# EAGLE design main_smd_v13 (EAGLE 5.11)
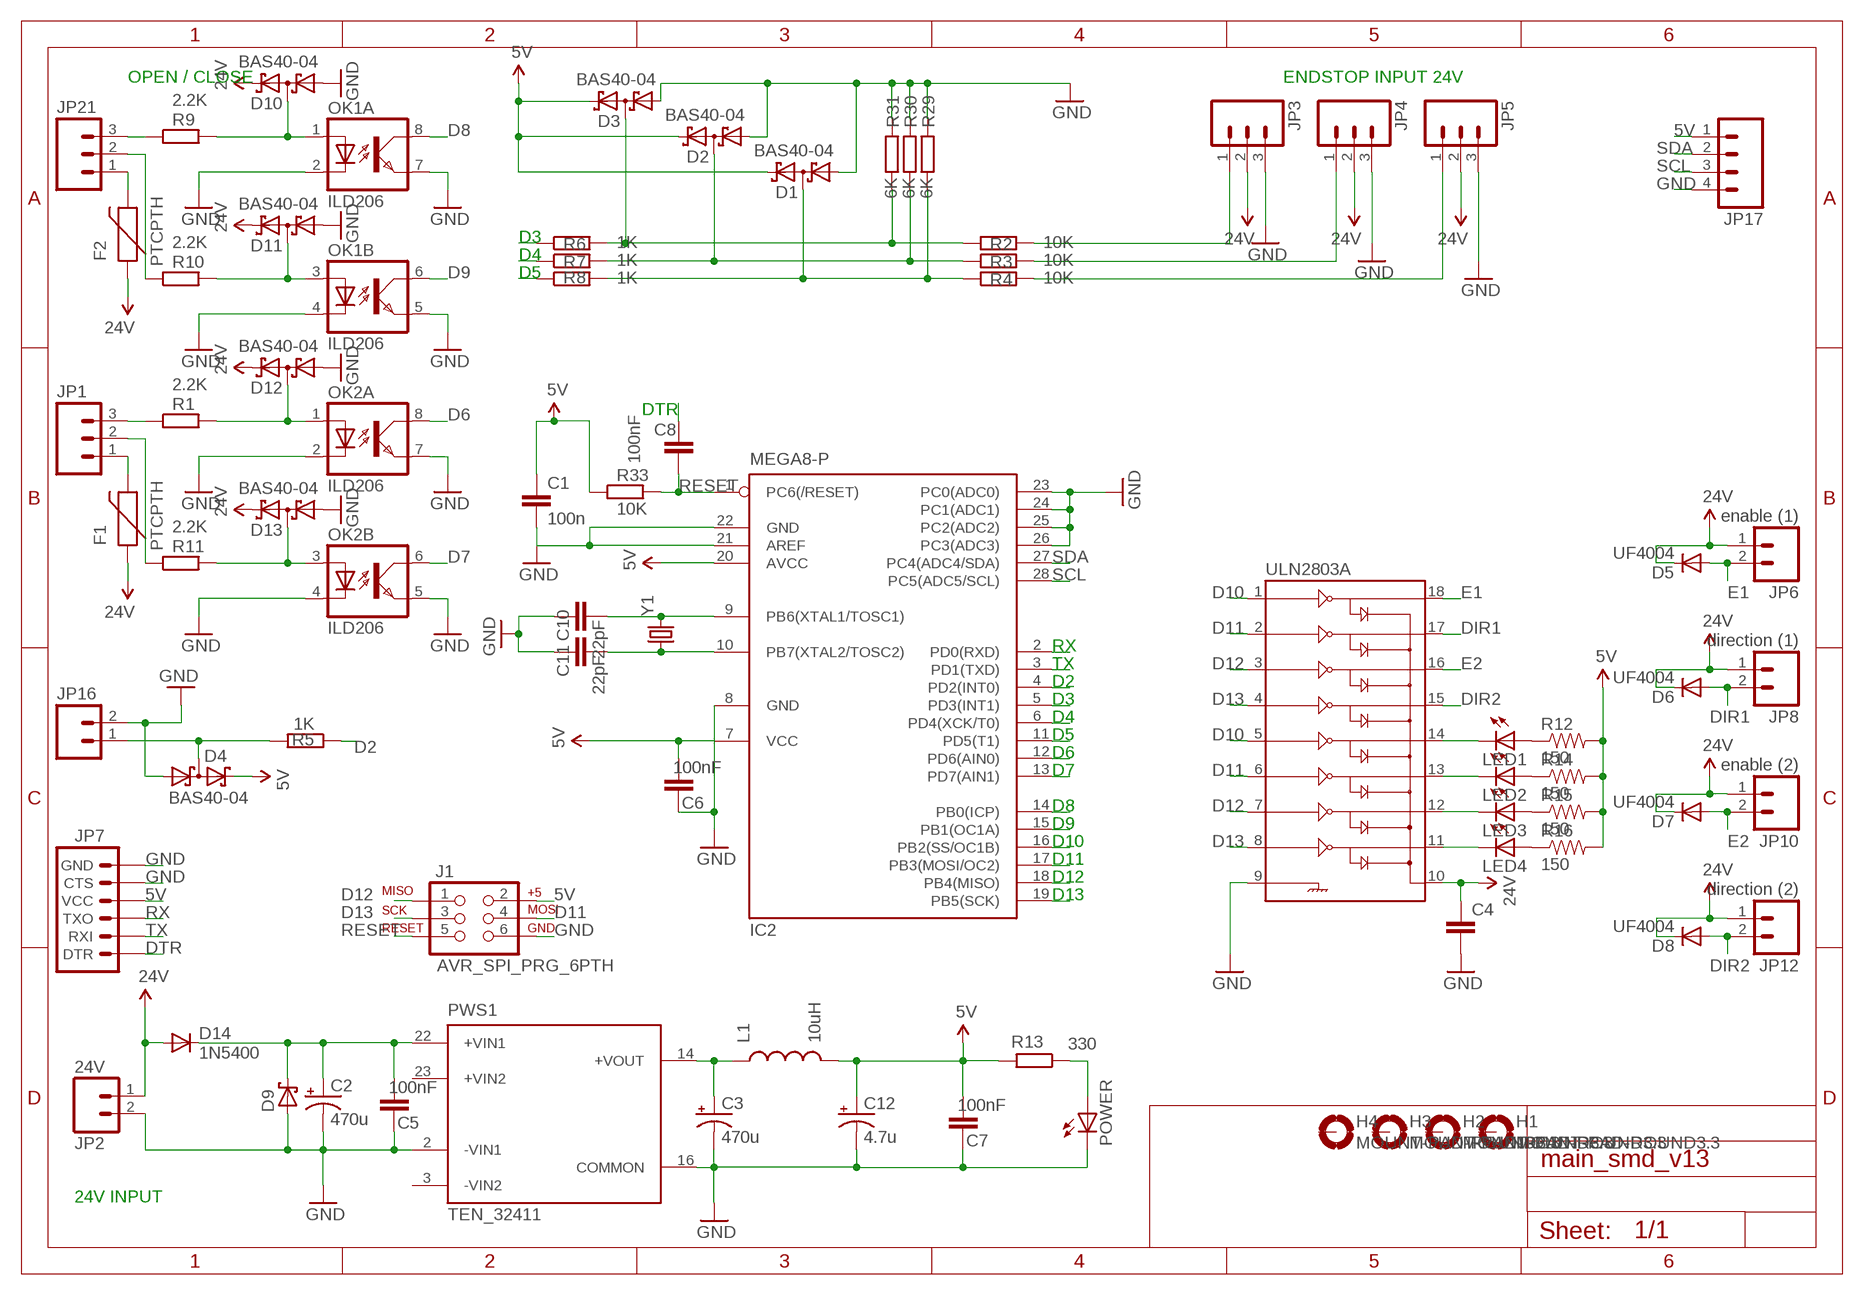
[diagram p0: schematic, sheet 1]

## Parts
C1  100n  CAP0805  [0805]
C2  470u  CAP_POLE  [PANASONIC_E]
C3  470u  CAP_POLD  [PANASONIC_D]
C4  CAP0805  [0805]
C5  100nF  CAP1210  [1210]
C6  100nF  CAP1210  [1210]
C7  100nF  CAP1210  [1210]
C8  100nF  CAP0805  [0805]
C10  22pF  CAP0805  [0805]
C11  22pF  CAP0805  [0805]
C12  4.7u  CAP_POLSMD  [VISHAY_C]
D1  BAS40-04  [SOT23]
D2  BAS40-04  [SOT23]
D3  BAS40-04  [SOT23]
D4  BAS40-04  [SOT23]
D5  UF4004  1N4004  [DO41-10]
D6  UF4004  1N4004  [DO41-10]
D7  UF4004  1N4004  [DO41-10]
D8  UF4004  1N4004  [DO41-10]
D9  SCHOTTKY-DIODECB417-15  [CB417-15]
D10  BAS40-04  [SOT23]
D11  BAS40-04  [SOT23]
D12  BAS40-04  [SOT23]
D13  BAS40-04  [SOT23]
D14  1N5400  [DO201-15]
F1  PTCPTH  [PTC]
F2  PTCPTH  [PTC]
H1  MOUNT-PAD-ROUND3.3  [3,3-PAD]
H2  MOUNT-PAD-ROUND3.3  [3,3-PAD]
H3  MOUNT-PAD-ROUND3.3  [3,3-PAD]
H4  MOUNT-PAD-ROUND3.3  [3,3-PAD]
IC2  MEGA8-P  [DIL28-3]
J1  AVR_SPI_PRG_6PTH  [2X3]
JP1  M03SCREW  [SCREWTERMINAL-3.5MM-3]
JP2  24V  M023.5MM_LOCK  [SCREWTERMINAL-3.5MM-2_LOCK]
JP3  M03SCREW  [SCREWTERMINAL-3.5MM-3]
JP4  M03SCREW  [SCREWTERMINAL-3.5MM-3]
JP5  M03SCREW  [SCREWTERMINAL-3.5MM-3]
JP6  enable (1)  M023.5MM_LOCK  [SCREWTERMINAL-3.5MM-2_LOCK]
JP7  ARDUINO_SERIAL_PROGRAMLONGPADS  [1X06_LONGPADS]
JP8  direction (1)  M023.5MM_LOCK  [SCREWTERMINAL-3.5MM-2_LOCK]
JP10  enable (2)  M023.5MM_LOCK  [SCREWTERMINAL-3.5MM-2_LOCK]
JP12  direction (2)  M023.5MM_LOCK  [SCREWTERMINAL-3.5MM-2_LOCK]
JP16  M023.5MM_LOCK  [SCREWTERMINAL-3.5MM-2_LOCK]
JP17  M04LONGPADS  [1X04_LONGPADS]
JP21  M03SCREW  [SCREWTERMINAL-3.5MM-3]
L1  10uH  INDUCTORSRU5028  [SRU5028]
LED1  LED1206  [LED-1206]
LED2  LED1206  [LED-1206]
LED3  LED1206  [LED-1206]
LED4  LED1206  [LED-1206]
OK1  ILD206  [SOIC08]
OK2  ILD206  [SOIC08]
POWER  LED1206  [LED-1206]
PWS1  TEN_32411  [TEN3XXXX]
R1  2.2K  R-EU_R1210  [R1210]
R2  10K  R-EU_R0805  [R0805]
R3  10K  R-EU_R0805  [R0805]
R4  10K  R-EU_R0805  [R0805]
R5  1K  R-EU_R0805  [R0805]
R6  1K  R-EU_R0805  [R0805]
R7  1K  R-EU_R0805  [R0805]
R8  1K  R-EU_R0805  [R0805]
R9  2.2K  R-EU_R1210  [R1210]
R10  2.2K  R-EU_R1210  [R1210]
R11  2.2K  R-EU_R1210  [R1210]
R12  150  RESISTOR0805-RES  [0805]
R13  330  R-EU_R1210  [R1210]
R14  150  RESISTOR0805-RES  [0805]
R15  150  RESISTOR0805-RES  [0805]
R16  150  RESISTOR0805-RES  [0805]
R29  6K  R-EU_R0805  [R0805]
R30  6K  R-EU_R0805  [R0805]
R31  6K  R-EU_R0805  [R0805]
R33  10K  R-EU_R0805  [R0805]
ULN2803A  ULN2803SOICW  [SO18L]
Y1  CRYSTALSMD  [HC49UP]

## Nets
1.0V [POWER]: C4.1 D5.C D6.C D7.C D8.C D10.2(C2) D11.2(C2) D12.2(C2) D13.2(C2) D14.A F1.P$1 F2.P$1 JP2.1 JP3.2 JP4.2 JP5.2 JP6.1 JP8.1 JP10.1 JP12.1 ULN2803A.10 ; supply symbol labelled 24V
5V [POWER]: C1.1 C6.2 C7.2 C12.+ D1.2(C2) D2.2(C2) D3.2(C2) D4.2(C2) IC2.7(VCC) IC2.20(AVCC) J1.2 JP7.4(VCC) JP17.1 L1.2 R12.2 R13.2 R14.2 R15.2 R16.2 R33.1
D2: IC2.4(PD2(INT0)) R5.1
D3: IC2.5(PD3(INT1)) R6.1
D4: IC2.6(PD4(XCK/T0)) R7.1
D5: IC2.11(PD5(T1)) R8.1
D6: IC2.12(PD6(AIN0)) OK2.8(A:COL)
D7: IC2.13(PD7(AIN1)) OK2.6(B:COL)
D8: IC2.14(PB0(ICP)) OK1.8(A:COL)
D9: IC2.15(PB1(OC1A)) OK1.6(B:COL)
D10: IC2.16(PB2(SS/OC1B)) ULN2803A.1 ULN2803A.5
D11: IC2.17(PB3(MOSI/OC2)) J1.4 ULN2803A.2 ULN2803A.6
D12: IC2.18(PB4(MISO)) J1.1 ULN2803A.3 ULN2803A.7
D13: IC2.19(PB5(SCK)) J1.3 ULN2803A.4 ULN2803A.8
DIR1: D6.A JP8.2 ULN2803A.17
DIR2: D8.A JP12.2 ULN2803A.15
DTR: C8.1 JP7.1(DTR)
E1: D5.A JP6.2 ULN2803A.18
E2: D7.A JP10.2 ULN2803A.16
GND [POWER]: C1.2 C2.- C3.- C4.2 C5.1 C6.1 C7.1 C10.1 C11.1 C12.- D1.1(A1) D2.1(A1) D3.1(A1) D4.1(A1) D9.A D10.1(A1) D11.1(A1) D12.1(A1) D13.1(A1) IC2.8(GND) IC2.21(AREF) IC2.22(GND) IC2.23(PC0(ADC0)) IC2.24(PC1(ADC1)) IC2.25(PC2(ADC2)) IC2.26(PC3(ADC3)) J1.6 JP2.2 JP3.3 JP4.3 JP5.3 JP7.5(CTS) JP7.6(GND) JP16.2 JP17.4 OK1.2(A:C) OK1.4(B:C) OK1.5(B:EMIT) OK1.7(A:EMIT) OK2.2(A:C) OK2.4(B:C) OK2.5(B:EMIT) OK2.7(A:EMIT) POWER.C PWS1.2(-VIN1) PWS1.16(COMMON) R29.2 R30.2 R31.2 ULN2803A.9
N$1: JP21.3 R9.1
N$2: D10.3(C1A2) OK1.1(A:A) R9.2
N$3: JP3.1 R2.2
N$4: D4.3(C1A2) JP16.1 R5.2
N$5: JP4.1 R3.2
N$6: JP5.1 R4.2
N$7: JP21.2 R10.1
N$8: D11.3(C1A2) OK1.3(B:A) R10.2
N$9: D3.3(C1A2) R2.1 R6.2 R31.1
N$10: POWER.A R13.1
N$11: JP1.3 R1.1
N$12: D2.3(C1A2) R3.1 R7.2 R30.1
N$13: D1.3(C1A2) R4.1 R8.2 R29.1
N$14: D12.3(C1A2) OK2.1(A:A) R1.2
N$15: JP1.2 R11.1
N$16: D13.3(C1A2) OK2.3(B:A) R11.2
N$17: F2.P$2 JP21.1
N$18: F1.P$2 JP1.1
N$19: LED3.A R15.1
N$20: LED1.A R12.1
N$21: LED2.A R14.1
N$22: LED4.A R16.1
N$23: LED1.C ULN2803A.14
N$24: C10.2 IC2.9(PB6(XTAL1/TOSC1)) Y1.2
N$25: C11.2 IC2.10(PB7(XTAL2/TOSC2)) Y1.1
N$26: LED2.C ULN2803A.13
N$27: LED3.C ULN2803A.12
N$28: LED4.C ULN2803A.11
N$30 [POWER]: C2.+ C5.2 D9.C D14.C PWS1.22(+VIN1)
N$32 [POWER]: C3.+ L1.1 PWS1.14(+VOUT)
RESET: C8.2 IC2.1(PC6(/RESET)) J1.5 R33.2
RX: IC2.2(PD0(RXD)) JP7.3(TXO)
SCL: IC2.28(PC5(ADC5/SCL)) JP17.3
SDA: IC2.27(PC4(ADC4/SDA)) JP17.2
TX: IC2.3(PD1(TXD)) JP7.2(RXI)
Unconnected: H1.B3,3(MOUNT) H2.B3,3(MOUNT) H3.B3,3(MOUNT) H4.B3,3(MOUNT) PWS1.3(-VIN2) PWS1.23(+VIN2)

## Notes on the sheet
- OPEN / CLOSE | ENDSTOP INPUT 24V
- D3
- D4
- D5
- DTR
- RX
- TX
- D2
- D3
- D4
- D5
- D6
- D7
- D8
- D9
- D10
- D11
- D12
- D13
- 24V INPUT

## Library data of the parts
C1 C4-C8 C10 C11 = SparkFun:CAP: Capacitor Standard 0603 ceramic capacitor, and 0.1" leaded capacitor.
C2 C3 C12 = SparkFun:CAP_POL: Capacitor Polarized These are standard SMD and PTH capacitors. Normally 10uF, 47uF, and 100uF in electrolytic and tantalum varieties. Always verify the external diameter of the through hole cap, it varies with capacity, voltage, and manufacturer. The EIA devices should be standard.
D1-D4 D10-D13 = diode:BAS40-04: Silicon Schottky Diodes General-purpose diode for high-speed switching
D5-D8 = diode:1N4004: DIODE general purpose rectifier, 1 A
D9 = diode:SCHOTTKY-DIODE: Schottky Diode
D14 = diode:1N5400: DIODE standard rectifier, 3 A, 50 V (Motorola)
F1 F2 = SparkFun:PTC: Resettable Fuse PTC Resettable Fuse. Spark Fun Electronics SKU : COM-08357
H1-H4 = holes:MOUNT-PAD-ROUND: MOUNTING PAD, round
IC2 = atmel:MEGA8-P: MICROCONTROLLER 8 Kbytes FLASH, 1 kbytes SRAM, 512 bytes EEPROM, USART, 4-channel 10 bit ADC, 2-channel 8 bit ADC Pin compatible with Atmega48, ATMega88, ATMega168 Source: avr.lbr; OC_FARNELL: unknown; OC_NEWARK: unknown
J1 = SparkFun:AVR_SPI_PRG_6: AVR ISP 6 Pin This is the reduced ISP connector for AVR programming. Common on Arduino. This footprint will take up less PCB space and can be used with a 10-pin to 6-pin adapter such as SKU: BOB-08508
JP1 JP3-JP5 JP21 = SparkFun:M03: Header 3 Standard 3-pin 0.1" header. Use with straight break away headers (SKU : PRT-00116), right angle break away headers (PRT-00553), swiss pins (PRT-00743), machine pins (PRT-00117), and female headers (PRT-00115). Molex polarized connector foot print use with SKU : PRT-08232 with associated crimp pins and housings.
JP2 JP6 JP8 JP10 JP12 JP16 = SparkFun:M02: Header 2 Standard 2-pin 0.1" header. Use with straight break away headers (SKU : PRT-00116), right angle break away headers (PRT-00553), swiss pins (PRT-00743), machine pins (PRT-00117), and female headers (PRT-00115). Molex polarized connector foot print use with SKU : PRT-08233 with associated crimp pins and housings.
JP7 = SparkFun:ARDUINO_SERIAL_PROGRAM
JP17 = SparkFun:M04: Header 4 Standard 4-pin 0.1" header. Use with straight break away headers (SKU : PRT-00116), right angle break away headers (PRT-00553), swiss pins (PRT-00743), machine pins (PRT-00117), and female headers (PRT-00115). Molex polarized connector foot print use with SKU : PRT-08231 with associated crimp pins and housings. 1MM SMD Version SKU: PRT-10208
L1 = SparkFun:INDUCTOR: Inductors Basic Inductor/Choke - 0603 and 1206. Footprints are not proven and vary greatly between part numbers.
LED1-LED4 POWER = SparkFun:LED: LEDs Standard schematic elements and footprints for 5mm, 3mm, 1206, and 0603 sized LEDs. 5mm - Spark Fun Electronics SKU : COM-00529 (and others)
OK1 OK2 = optocoupler:ILD2*: Siemens ILD205/206/207/211/213/217 DUAL PHOTOTRANSISTOR SMALL OUTLINE SURFACE MOUNT OPTOCOUPLER Source: 153385-da-01-en-Optocoupler_ILD205-T.pdf; MF: VISHAY/TELEFUNKEN; MPN: ILD206T; OC_FARNELL: 1045450; OC_NEWARK: 01H7271
PWS1 = traco-electronic:TEN_3*: DC/DC Konverter 3 Watt, 2 x Input, 1 x Output Source: http://www.tracopower.com/datasheet_g/ten3-d.pdf; MPN: TEN3-2411; OC_FARNELL: unknown; OC_NEWARK: 45K1582
R1-R11 R13 R29-R31 R33 = resistor:R-EU_: RESISTOR, European symbol
R12 R14-R16 = SparkFun:RESISTOR: Resistor Basic schematic elements and footprints for 0603, 1206, and PTH resistors.
ULN2803A = SparkFun:ULN2803: Darlington Driver ULN2803 Darlington array. 500mA max per channel, 8-channel package. Spark Fun Electronics SKU : COM-00312
Y1 = SparkFun:CRYSTAL: Crystals Various standard crystals. Proven footprints. Spark Fun Electronics SKU : COM-00534

## Net classes
0 default: width 0.406 mm, drill 0.61 mm, clearance 0.254 mm
2 POWER: width 0.711 mm, drill 0.635 mm, clearance 0.254 mm

## Board
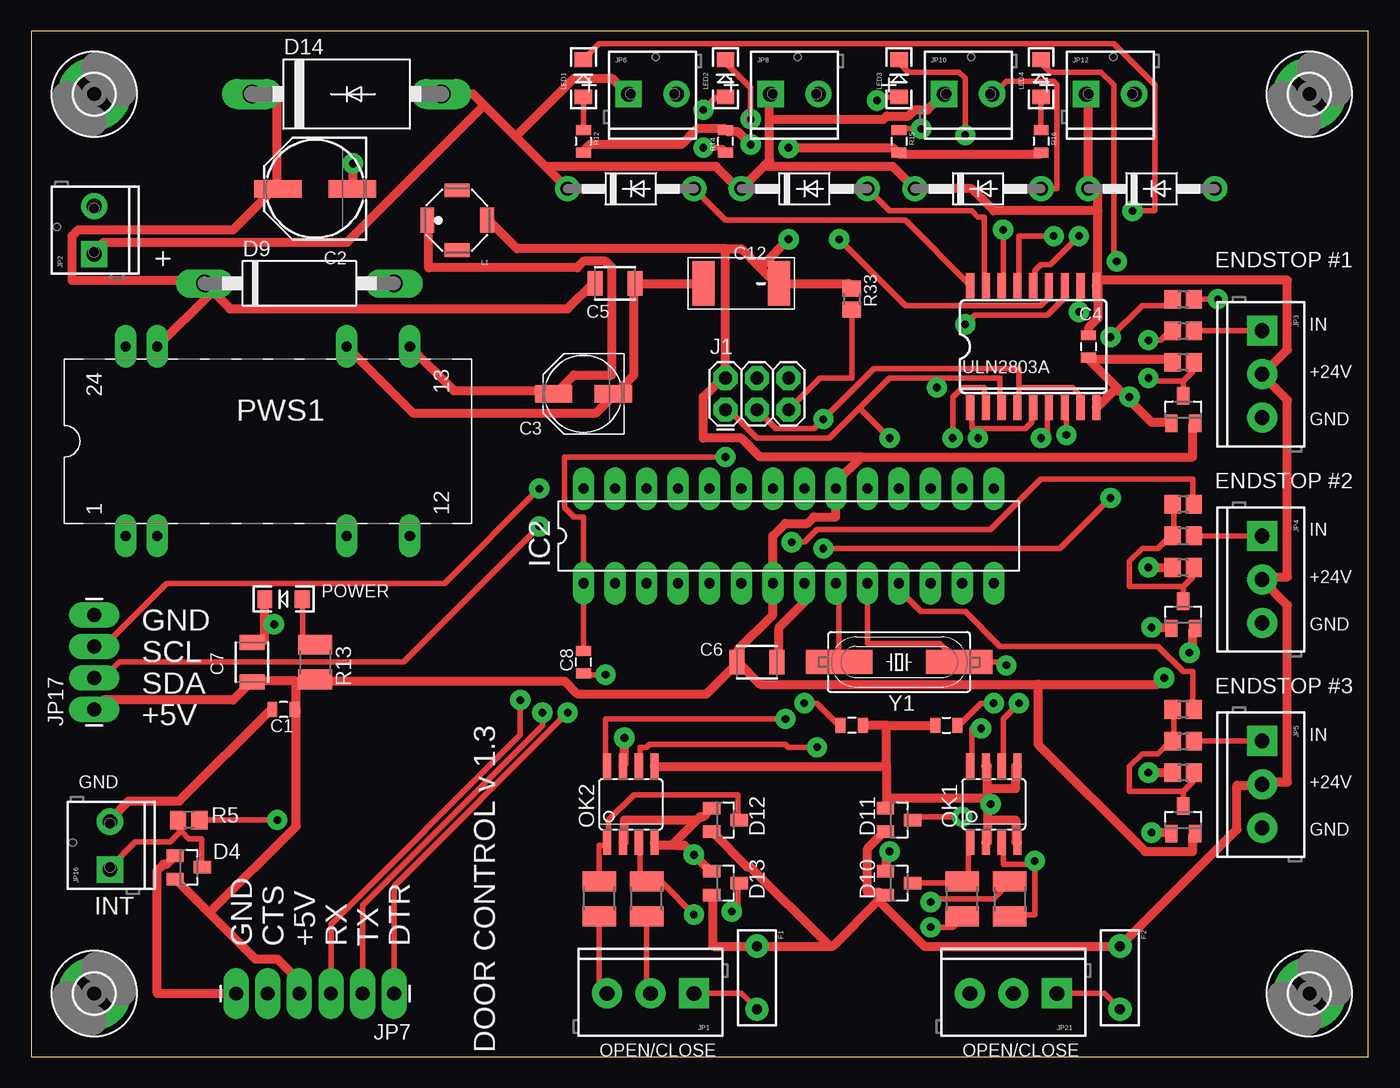
[diagram p1: board, top side]
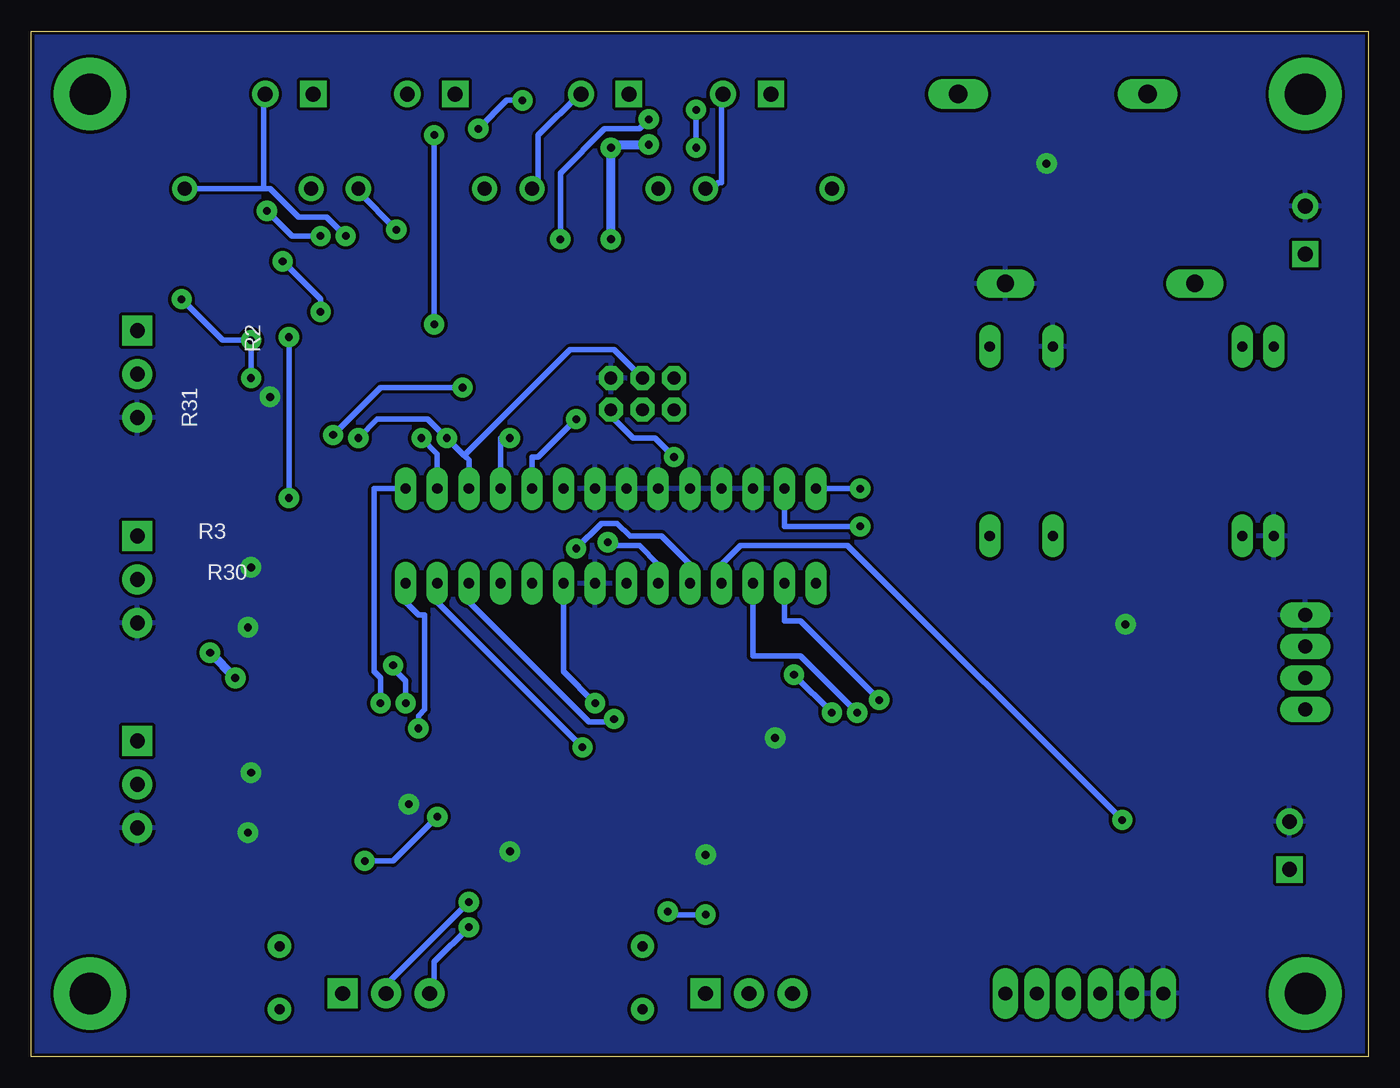
[diagram p2: board, bottom side, seen from below]

Size 107.62 x 82.54 mm. Coordinates in mm from the lower left corner, seen from the top.
Outline: 0,0 107.62,0 107.62,82.54 0,82.54 0,0
Copper layers (1*16): Top 0.035mm / dielectric 1.5mm / Bottom 0.035mm
Design rules "laboratory *": minimum track width 18mil, minimum drill 22mil, track to track 8mil, track to pad 12mil, pad to pad 10mil, via to via 8mil, smd to smd 8mil, copper to edge 10mil, drill to drill 10mil, minimum pad ring 18mil, minimum via ring 20mil, stop-mask expansion 4mil, vias tented up to drill 0mil, thermal gap 10mil

### Footprints (pad centres in the part's own frame; a part is rotated, then mirrored left to right if it is on the bottom)
0805 = smd 0.8 x 1.2: 1 -0.9,0; 2 0.9,0
PANASONIC_E = smd 3.8 x 1.4: + 3,0; - -3,0
PANASONIC_D = smd 3 x 1.4: + 2.4,0; - -2.4,0
1210 = smd 1.2 x 2: 1 -1.6,0; 2 1.6,0
VISHAY_C = smd 3.556 x 1.778: + 0,3.048; - 0,-3.048
SOT23 = smd 1 x 1.4: 1 -0.95,-1.1; 2 0.95,-1.1; 3 0,1.1
DO41-10 = drill 1.118 round: A 5.08,0; C -5.08,0
CB417-15 = drill 1.397 long: A 7.62,0; C -7.62,0
DO201-15 = drill 1.499 long: A 7.62,0; C -7.62,0
PTC = drill 0.8 pad 1.88 round: P$1 -2.54,0; P$2 2.54,0
3,3-PAD = drill 3.3 pad 5.842 round: B3,3 0,0
DIL28-3 = drill 0.813 long: 1 -16.51,-3.81; 2 -13.97,-3.81; 3 -11.43,-3.81; 4 -8.89,-3.81; 5 -6.35,-3.81; 6 -3.81,-3.81; 7 -1.27,-3.81; 8 1.27,-3.81; 9 3.81,-3.81; 10 6.35,-3.81; 11 8.89,-3.81; 12 11.43,-3.81; 13 13.97,-3.81; 14 16.51,-3.81; 15 16.51,3.81; 16 13.97,3.81; 17 11.43,3.81; 18 8.89,3.81; 19 6.35,3.81; 20 3.81,3.81; 21 1.27,3.81; 22 -1.27,3.81; 23 -3.81,3.81; 24 -6.35,3.81; 25 -8.89,3.81; 26 -11.43,3.81; 27 -13.97,3.81; 28 -16.51,3.81
2X3 = drill 1.016 pad 1.88 octagon: 1 0,0; 2 0,2.54; 3 2.54,0; 4 2.54,2.54; 5 5.08,0; 6 5.08,2.54
SCREWTERMINAL-3.5MM-3 = drill 1.2 pad 2.413 square: 1 0,0 | drill 1.2 pad 2.413 round: 2 3.5,0; 3 7,0
SCREWTERMINAL-3.5MM-2_LOCK = drill 1.2 pad 2.032 square: 1 -0.178,0 | drill 1.2 pad 2.032 round: 2 3.678,0
1X06_LONGPADS = drill 1.118 pad 1.88 long: 1 0,0; 2 2.54,0; 3 5.08,0; 4 7.62,0; 5 10.16,0; 6 12.7,0
1X04_LONGPADS = drill 1.118 pad 1.88 long: 1 0,0; 2 2.54,0; 3 5.08,0; 4 7.62,0
SRU5028 = smd 1.1 x 2: 1 2.4,0; 2 -2.4,0 | smd 2 x 1.1: P$1 0,2.4; P$2 0,-2.4
LED-1206 = smd 1.2 x 1.4: A -1.5,0; C 1.5,0
SOIC08 = smd 0.66 x 2.032: 1 -1.905,-3.073; 2 -0.635,-3.073; 3 0.635,-3.073; 4 1.905,-3.073; 5 1.905,3.073; 6 0.635,3.073; 7 -0.635,3.073; 8 -1.905,3.073
TEN3XXXX = drill 0.813 pad 1.422 long: 2 -11.43,-7.62; 3 -8.89,-7.62; 9 6.35,-7.62; 11 11.43,-7.62; 14 11.43,7.62; 16 6.35,7.62; 22 -8.89,7.62; 23 -11.43,7.62
R1210 = smd 1.6 x 2.7: 1 -1.4,0; 2 1.4,0
R0805 = smd 1.3 x 1.5: 1 -0.85,0; 2 0.85,0
SO18L = smd 0.66 x 2.032: 1 -0.635,-4.902; 2 0.635,-4.902; 3 1.905,-4.902; 4 3.175,-4.902; 5 4.445,-4.902; 6 5.715,-4.902; 7 6.985,-4.902; 8 8.255,-4.902; 9 9.525,-4.902; 10 9.525,4.902; 11 8.255,4.902; 12 6.985,4.902; 13 5.715,4.902; 14 4.445,4.902; 15 3.175,4.902; 16 1.905,4.902; 17 0.635,4.902; 18 -0.635,4.902
HC49UP = smd 5.334 x 1.93: 1 -4.826,0; 2 4.826,0

### Placement (x,y rotation side)
C1  20.32,27.94 180 top
C2  22.86,69.85 180 top
C3  44.45,53.34 180 top
C4  85.09,57.15 270 top
C5  46.99,62.23 180 top
C6  58.42,31.75 180 top
C7  17.78,31.75 270 top
C8  44.45,31.75 90 top
C10  66.04,26.67 180 top
C11  73.66,26.67 0 top
C12  57.15,62.23 270 top
D1  92.71,19.05 0 top
D2  92.71,35.56 0 top
D3  92.71,52.07 0 top
D4  12.7,15.24 270 top
D5  48.26,69.85 0 top
D6  62.23,69.85 0 top
D7  76.2,69.85 0 top
D8  90.17,69.85 0 top
D9  21.59,62.23 0 top
D10  69.85,13.97 270 top
D11  69.85,19.05 270 top
D12  55.88,19.05 270 top
D13  55.88,13.97 270 top
D14  25.4,77.47 0 top
F1  58.42,6.35 270 top
F2  87.63,6.35 270 top
H1  5.08,77.47 0 top
H2  102.87,77.47 0 top
H3  5.08,5.08 0 top
H4  102.87,5.08 0 top
IC2  60.96,41.91 0 top
J1  55.88,52.07 0 top
JP1  53.34,5.08 180 top
JP2  5.08,64.77 90 top
JP3  99.06,58.42 270 top
JP4  99.06,41.91 270 top
JP5  99.06,25.4 270 top
JP6  48.26,77.47 0 top
JP7  29.21,5.08 180 top
JP8  59.69,77.47 0 top
JP10  73.66,77.47 0 top
JP12  85.09,77.47 0 top
JP16  6.35,15.24 90 top
JP17  5.08,27.94 90 top
JP21  82.55,5.08 180 top
L1  34.29,67.31 180 top
LED1  44.45,78.74 90 top
LED2  55.88,78.74 90 top
LED3  69.85,78.74 90 top
LED4  81.28,78.74 90 top
OK1  77.47,20.32 0 top
OK2  48.26,20.32 0 top
POWER  20.32,36.83 180 top
PWS1  19.05,49.53 0 top
R1  45.72,12.7 90 top
R2  92.71,58.42 0 top
R3  92.71,41.91 0 top
R4  92.71,25.4 0 top
R5  12.7,19.05 180 top
R6  92.71,60.96 0 top
R7  92.71,44.45 180 top
R8  92.71,27.94 180 top
R9  74.93,12.7 90 top
R10  78.74,12.7 270 top
R11  49.53,12.7 90 top
R12  44.45,73.66 270 top
R13  22.86,31.75 270 top
R14  55.88,73.66 90 top
R15  69.85,73.66 270 top
R16  81.28,73.66 270 top
R29  92.71,22.86 180 top
R30  92.71,39.37 180 top
R31  92.71,55.88 180 top
R33  66.04,60.96 270 top
ULN2803A  76.2,57.15 0 top
Y1  69.85,31.75 180 top

### Tracks (layer width: path | path; a pad name or v marks a point on that pad's centre or on a via)
1.0V
  Top 0.711: D13.2 54.86,12.95 54.86,8.89 F1.P$1 64.01,8.89 | 68.2,12.57 64.52,8.89 64.01,8.89 | 68.2,12.57 68.58,12.95 D10.2 68.33,13.21 67.31,13.21 67.31,16.76 68.58,18.03 D11.2 | D12.2 54.86,18.03 57.66,15.24 57.91,15.24 64.01,9.14 64.01,8.89 | 68.2,12.57 71.88,8.89 F2.P$1 97.03,18.29 97.03,21.84 99.06,21.84 JP5.2 99.31,22.1 101.09,22.1 101.09,36.32 99.06,38.35 JP4.2 99.31,38.61 101.09,38.61 101.09,52.83 99.06,54.86 JP3.2 99.31,55.12 101.09,56.9 101.09,62.48 85.85,62.48 | C4.1 85.09,58.67 85.85,59.44 85.85,61.98 ULN2803A.10 85.85,62.23 85.85,62.48 | 85.85,68.07 85.85,69.85 D8.C 85.09,77.47 JP12.1 | 85.85,62.48 85.85,68.07 | 59.05,71.75 59.44,72.14 59.44,75.44 | 59.05,71.75 D6.C 56.9,69.85 55.12,71.63 41.66,71.63 41.53,71.5 | 59.44,75.44 59.44,77.47 JP8.1 | 59.05,71.75 59.18,71.63 69.34,71.63 D7.C 75.69,69.85 77.47,68.07 85.85,68.07 | JP10.1 73.41,77.47 72.14,76.2 71.12,76.2 70.61,75.69 68.83,75.69 68.58,75.44 59.44,75.44 | 36.45,76.58 35.56,77.47 D14.A | 38.99,74.04 36.45,76.58 | 41.53,71.5 38.99,74.04 | 41.53,71.5 D5.C | JP2.1 5.08,64.77 5.84,65.53 25.4,65.53 36.45,76.58 | JP6.1 48.01,77.47 46.74,78.74 43.69,78.74 38.99,74.04
5V  (via drill 0.64)
  Top 0.711: R16.2 81.28,72.64 69.85,72.64 R15.2 69.6,72.9 69.34,73.15 v60.96,73.15 | R12.2 44.45,72.9 44.96,73.41 52.32,73.41 53.59,74.68 55.88,74.68 R14.2 56.13,74.42 56.9,74.42 v57.91,73.41 | R33.1 66.04,61.98 65.79,62.23 C12.+ 59.94,62.23 58.55,63.63 | 55.88,65.02 57.15,65.02 58.55,63.63 | 55.88,65.02 39.12,65.02 36.83,67.31 L1.2 | 55.88,65.02 J1.2 55.63,54.61 54.1,53.09 54.1,49.78 57.15,49.78 58.67,48.26 66.8,48.26 | v60.96,65.79 58.93,63.75 58.67,63.75 58.55,63.63 | 14.35,11.56 18.03,7.87 19.81,7.87 21.59,6.1 JP7.4 | 14.35,11.56 11.68,14.22 D4.2 | 21.34,30.23 21.34,27.94 C1.1 21.34,27.69 21.34,18.54 14.35,11.56 | 21.34,30.23 22.86,30.23 R13.2 23.11,30.23 42.93,30.23 43.94,29.21 54.36,29.21 56.64,31.5 C6.2 | 21.34,30.23 17.78,30.23 C7.2 17.53,29.97 16.26,28.7 5.84,28.7 JP17.1 | 66.8,48.26 93.47,48.26 93.47,50.8 D3.2 | 66.8,48.26 64.77,46.23 IC2.20 64.77,43.43 62.99,43.43 62.48,42.93 60.71,42.93 59.69,41.91 IC2.7 59.69,35.56 56.9,32.77 56.9,32 C6.2 | 81.03,29.97 81.03,25.15 89.66,16.51 93.47,16.51 93.47,17.78 D1.2 | 81.03,29.97 58.67,29.97 56.9,31.75 C6.2 | v93.22,32.51 93.47,32.51 93.47,34.29 D2.2 | v91.19,30.48 90.68,29.97 81.03,29.97
  Bottom 0.711: v57.91,73.41 60.71,73.41 v60.96,73.15 v60.96,65.79 | v91.19,30.48 v93.22,32.51
D2  (via drill 0.61)
  Top 0.457: R5.1 v19.81,19.05
  Bottom 0.457: v19.81,19.05 41.91,41.15 50.55,41.15 52.07,39.62 IC2.4
D3  (via drill 0.61)
  Top 0.457: v86.87,57.91 89.41,60.45 91.19,60.45 91.69,60.96 R6.1 | v86.87,44.96 82.8,40.89 v63.75,40.89
  Bottom 0.457: v86.87,44.96 v86.87,57.91 | v63.75,40.89 61.72,42.93 60.45,42.93 59.44,41.91 56.9,41.91 54.61,39.62 IC2.5
D4  (via drill 0.61)
  Top 0.457: v61.21,41.4 62.23,41.4 63.25,42.42 77.22,42.42 81.28,46.48 93.47,46.48 93.47,44.45 R7.1
  Bottom 0.457: v61.21,41.4 60.96,41.15 58.67,41.15 57.15,39.62 IC2.6
D5
  Top 0.457: IC2.11 69.85,37.59 71.63,35.81 75.18,35.81 77.98,33.02 90.68,33.02 92.71,30.99 93.47,30.99 93.47,27.94 R8.1
D6  (via drill 0.61)
  Top 0.457: v60.71,27.18 46.23,27.18 46.23,23.62 OK2.8
  Bottom 0.457: v60.71,27.18 60.96,26.92 62.74,26.92 72.39,36.58 IC2.12
D7  (via drill 0.61)
  Top 0.457: v63.25,24.89 60.96,24.89 60.71,25.15 49.78,25.15 49.53,24.89 49.02,24.89 49.02,23.62 OK2.6
  Bottom 0.457: v63.25,24.89 74.93,36.58 IC2.13
D8  (via drill 0.61)
  Top 0.457: v76.45,26.42 75.69,26.42 75.69,23.62 OK1.8
  Bottom 0.457: v76.45,26.42 76.45,27.43 75.95,27.94 75.95,35.56 76.45,35.56 77.47,36.58 IC2.14
D9  (via drill 0.61)
  Top 0.457: v79.5,28.45 78.23,27.18 78.23,23.62 OK1.6
  Bottom 0.457: v79.5,28.45 79.5,30.48 80.01,30.99 80.01,45.72 IC2.15
D10  (via drill 0.61)
  Top 0.457: 76.2,50.55 80.01,50.55 80.52,51.05 80.52,52.07 ULN2803A.5 | 76.2,50.55 75.69,50.55 75.69,52.07 ULN2803A.1 | v76.2,49.78 76.2,50.55
  Bottom 0.457: IC2.16 74.93,48.51 v76.2,49.78
D11  (via drill 0.61)
  Top 0.457: v74.17,49.78 74.17,53.09 74.93,53.85 76.71,53.85 76.71,52.32 ULN2803A.2 | v81.28,49.78 81.79,49.78 81.79,52.07 ULN2803A.6
  Bottom 0.457: 72.77,48.39 72.39,48.01 IC2.17 | 72.77,48.39 v74.17,49.78 75.69,51.31 79.76,51.31 v81.28,49.78 | J1.4 60.71,56.9 64.26,56.9 72.77,48.39
D12  (via drill 0.61)
  Top 0.457: 72.9,54.61 69.09,54.61 66.67,52.2 | 72.9,54.61 77.98,54.61 77.98,52.32 ULN2803A.3 | 66.67,52.2 64.26,49.78 58.42,49.78 56.13,52.07 J1.1 | v83.31,50.04 83.31,52.07 ULN2803A.7 | 72.9,54.61 v72.9,53.85 | 66.67,52.2 v69.09,49.78
  Bottom 0.457: v83.31,50.04 79.5,53.85 v72.9,53.85 | IC2.18 69.85,49.78 v69.09,49.78
D13  (via drill 0.61)
  Top 0.457: 79.5,53.85 79.5,52.32 ULN2803A.4 | 79.5,53.85 83.82,53.85 84.33,53.34 84.33,52.32 ULN2803A.8 | J1.3 59.94,50.55 62.99,50.55 v63.75,51.31 67.82,55.37 79.5,55.37 79.5,53.85
  Bottom 0.457: IC2.19 67.31,48.26 66.8,48.26 v63.75,51.31
DIR1
  Top 0.457: D6.A 69.09,68.07 75.69,68.07 76.2,67.56 76.71,67.56 76.71,62.23 ULN2803A.17
  Bottom 0.457: D6.A 66.8,69.85 66.8,74.17 63.5,77.47 JP8.2
DIR2  (via drill 0.61)
  Top 0.457: v82.3,66.04 79.5,66.04 79.5,62.23 ULN2803A.15
  Bottom 0.457: v82.3,66.04 83.82,67.56 86.11,67.56 88.39,69.85 88.9,69.85 | 88.9,69.85 D8.A | 88.9,69.85 88.9,77.47 JP12.2
DTR  (via drill 0.61)
  Top 0.457: v46.23,30.73 44.45,30.73 C8.1 | v43.18,27.69 29.21,13.72 JP7.1
  Bottom 0.457: v43.18,27.69 v46.23,30.73
E1
  Top 0.457: D5.A 55.88,67.31 70.36,67.31 75.44,62.23 ULN2803A.18
  Bottom 0.457: D5.A 52.83,69.85 52.32,70.36 52.07,70.36 52.07,77.47 JP6.2
E2  (via drill 0.61)
  Top 0.457: v78.23,66.55 78.23,62.23 ULN2803A.16 | D7.A 82.55,69.85 82.55,78.23 82.3,78.49 78.49,78.49 77.47,77.47 JP10.2
  Bottom 0.457: v78.23,66.55 81.28,69.6 D7.A
GND  (via drill 0.64)
  Top 0.711: 76.96,21.59 76.96,23.37 OK1.7 | 76.96,20.83 76.96,21.59 | 76.96,20.83 76.96,20.32 | 76.96,20.32 76.96,19.05 | 76.96,19.05 76.96,17.27 OK1.2 | OK1.4 79.25,17.27 79.25,19.05 76.96,19.05 | OK1.5 79.25,23.37 79.25,21.59 76.96,21.59 | 68.83,26.67 C10.1 | 68.83,26.67 C11.1 | 68.83,23.37 68.83,20.83 | 68.83,20.83 68.83,20.07 D11.1 | 68.83,23.37 68.83,26.67 | OK2.5 50.29,23.37 68.83,23.37 | 68.83,20.83 76.96,20.83 | C12.- C5.1 48.51,61.98 48.51,54.86 46.99,53.34 C3.- 46.74,53.09 45.47,51.82 30.73,51.82 PWS1.16 | 51.82,17.02 50.29,17.02 OK2.4 | 51.82,17.02 52.58,17.02 v53.34,16.26 54.61,14.99 D13.1 | 53.47,18.92 51.82,17.27 51.82,17.02 | 53.47,18.92 53.85,19.3 54.1,19.3 54.61,19.81 D12.1 | OK2.2 47.75,17.27 47.75,19.05 53.34,19.05 53.47,18.92 | 88.27,52.96 90.17,51.05 91.69,51.05 D3.1 | 87.5,53.72 88.27,52.96 | 87.5,53.72 85.09,56.13 C4.2 85.34,56.13 91.44,56.13 91.69,55.88 R31.2 | ULN2803A.9 85.85,52.32 87.12,53.59 87.38,53.59 87.5,53.72 | 18.8,34.8 18.8,33.53 17.78,33.53 C7.1 | 18.8,34.8 18.8,36.83 POWER.C | C1.2 19.3,27.94 11.94,20.57 7.87,20.57 6.35,19.05 JP16.2 | JP7.6 10.16,5.08 10.16,14.99 10.67,15.49 10.92,15.49 11.43,16 D4.1 | v69.09,16.51 68.83,16.51 68.83,14.99 D10.1 | v90.17,18.03 91.69,18.03 D1.1 | v90.17,34.54 91.69,34.54 D2.1 | v89.92,22.86 R29.2 | v89.92,39.37 R30.2 | IC2.8 62.23,36.58 60.2,34.54 60.2,31.75 C6.1 | v47.75,25.65 47.75,23.62 OK2.7 | 18.8,34.8 v19.56,34.8 | v25.91,71.88 25.91,69.85 C2.- | 88.27,52.96 v88.39,53.09 | 76.96,20.32 v77.22,20.32
  pour Bottom: 0,82.55 107.95,82.55 107.95,0 0,0
N$1  (via drill 0.61)
  Top 0.457: v72.39,10.41 74.17,10.41 74.93,11.18 R9.1
  Bottom 0.457: v72.39,10.41 75.18,7.62 75.18,5.08 JP21.3
N$2
  Top 0.457: D10.3 74.93,13.97 R9.2 74.93,14.22 75.44,14.22 75.44,17.02 OK1.1
N$3
  Top 0.457: R2.2 JP3.1
N$4
  Top 0.457: 12.06,18.16 11.94,18.29 11.94,19.05 R5.2 | 12.06,18.16 12.7,17.53 13.72,17.53 13.72,15.24 D4.3 | 12.06,18.16 11.18,17.27 8.38,17.27 6.35,15.24 JP16.1
N$5
  Top 0.457: R3.2 JP4.1
N$6
  Top 0.457: R4.2 JP5.1
N$7  (via drill 0.61)
  Top 0.457: v72.39,12.45 72.64,12.7 77.47,12.7 78.74,13.97 R10.1
  Bottom 0.457: v72.39,12.45 78.99,5.84 78.99,5.08 JP21.2
N$8  (via drill 0.61)
  Top 0.457: v74.93,19.3 71.37,19.3 71.12,19.05 D11.3 | 80.77,15.49 80.77,11.43 78.74,11.43 R10.2 | 80.77,15.49 78.23,15.49 78.23,17.02 OK1.3 | v80.77,15.75 80.77,15.49
  Bottom 0.457: v74.93,19.3 78.49,15.75 v80.77,15.75
N$9  (via drill 0.61)
  Top 0.457: 92.71,54.36 93.47,55.12 93.47,55.88 R31.1 | D3.3 92.71,54.36 | v89.92,57.66 90.93,57.66 91.69,58.42 R2.1 | v89.92,54.61 90.17,54.36 92.71,54.36 | v95.5,60.96 R6.2
  Bottom 0.457: v89.92,54.61 v89.92,57.66 92.2,57.66 v95.5,60.96
N$10
  Top 0.457: POWER.A 21.84,36.83 21.84,33.27 22.86,33.27 R13.1
N$11
  Top 0.457: R1.1 45.72,5.08 JP1.3
N$12
  Top 0.457: R7.2 91.95,44.45 91.95,41.91 R3.1 91.69,41.91 90.68,40.89 89.41,40.89 88.39,39.88 88.39,37.85 92.71,37.85 | 92.71,37.85 93.47,38.61 93.47,39.37 R30.1 | 92.71,37.85 D2.3
N$13
  Top 0.457: R8.2 91.95,27.94 91.95,25.4 R4.1 91.69,25.4 90.68,24.38 89.41,24.38 88.39,23.37 88.39,21.34 92.71,21.34 | 92.71,21.34 93.47,22.1 93.47,22.86 R29.1 | 92.71,21.34 D1.3
N$14
  Top 0.457: D12.3 56.9,19.05 56.9,21.08 48.51,21.08 46.48,19.05 46.48,17.27 OK2.1 46.23,17.02 45.72,17.02 R1.2
N$15
  Top 0.457: R11.1 49.53,5.08 JP1.2
N$16  (via drill 0.61)
  Top 0.457: v56.39,11.68 56.9,11.68 56.9,13.97 D13.3 | v53.34,11.43 50.8,13.97 49.53,13.97 R11.2 49.53,14.22 49.02,14.22 49.02,17.02 OK2.3
  Bottom 0.457: v56.39,11.68 56.13,11.43 v53.34,11.43
N$17
  Top 0.457: F2.P$2 86.36,5.08 JP21.1
N$18
  Top 0.457: F1.P$2 57.15,5.08 JP1.1
N$19  (via drill 0.61)
  Top 0.457: v71.63,74.68 69.85,74.68 R15.1 | v68.07,76.96 68.33,77.22 69.85,77.22 LED3.A
  Bottom 0.457: v71.63,74.68 69.34,76.96 v68.07,76.96
N$20
  Top 0.457: R12.1 LED1.A
N$21  (via drill 0.61)
  Top 0.457: v54.1,73.15 55.63,73.15 55.88,72.9 R14.1 | v54.1,76.2 55.12,77.22 55.88,77.22 LED2.A
  Bottom 0.457: v54.1,73.15 v54.1,76.2
N$22
  Top 0.457: R16.1 LED4.A
N$23  (via drill 0.61)
  Top 0.457: v88.65,68.07 90.42,68.07 90.42,78.23 87.12,81.53 45.72,81.53 44.45,80.26 LED1.C | v84.33,66.04 82.04,63.75 81.28,63.75 80.77,63.25 80.77,62.23 ULN2803A.14
  Bottom 0.457: v88.65,68.07 86.61,66.04 v84.33,66.04
N$24  (via drill 0.61)
  Top 0.457: v62.23,28.45 63.25,28.45 65.02,26.67 C10.2 | Y1.2 65.02,38.1 IC2.9
  Bottom 0.457: v62.23,28.45 64.77,30.99 IC2.9
N$25  (via drill 0.61)
  Top 0.457: v77.47,28.45 76.45,28.45 74.68,26.67 C11.2 | v78.49,31.5 78.23,31.75 Y1.1 73.15,33.27 67.31,33.27 IC2.10
  Bottom 0.457: v77.47,28.45 77.47,30.23 78.49,31.24 v78.49,31.5
N$26  (via drill 0.61)
  Top 0.457: v57.91,75.44 57.91,77.98 55.88,80.01 LED2.C | v65.02,65.79 70.36,60.45 81.28,60.45 81.79,60.96 81.79,61.98 ULN2803A.13
  Bottom 0.457: v57.91,75.44 58.67,74.68 61.47,74.68 65.02,71.12 v65.02,65.79
N$27  (via drill 0.61)
  Top 0.457: v75.18,74.17 75.18,78.74 74.68,79.25 70.61,79.25 69.85,80.01 LED3.C | v75.18,58.93 75.95,59.69 81.79,59.69 83.06,60.96 83.06,61.98 ULN2803A.12
  Bottom 0.457: v75.18,58.93 v75.18,74.17
N$28  (via drill 0.61)
  Top 0.457: v87.38,64.01 87.12,64.01 87.12,78.23 86.11,79.25 82.04,79.25 81.28,80.01 LED4.C | v84.33,59.94 84.33,61.98 ULN2803A.11
  Bottom 0.457: v87.38,64.01 84.33,60.96 v84.33,59.94
N$30
  Top 0.711: D14.C 19.81,77.47 19.81,69.85 C2.+ 19.56,69.85 16.26,66.55 3.81,66.55 3.3,66.04 3.3,62.48 13.72,62.48 D9.C | D9.C 16,60.2 43.18,60.2 45.21,62.23 C5.2 | PWS1.22 14.48,61.47 D9.C
N$32
  Top 0.711: L1.1 32,67.31 32,63.5 43.94,63.5 44.45,64.01 46.23,64.01 46.74,63.5 46.74,54.86 43.69,54.86 42.16,53.34 C3.+ 41.91,53.59 34.04,53.59 PWS1.14
RESET  (via drill 0.61)
  Top 0.457: C8.2 IC2.1 44.45,43.43 43.69,43.43 42.93,44.2 42.93,48.26 v55.88,48.26 | J1.5 63.5,54.61 66.04,54.61 R33.2
  Bottom 0.457: v55.88,48.26 57.4,49.78 59.18,49.78 60.96,51.56 J1.5
RX  (via drill 0.61)
  Top 0.457: v39.37,28.7 39.37,25.91 24.13,10.67 JP7.3
  Bottom 0.457: IC2.2 46.99,35.05 45.72,35.05 v39.37,28.7
SCL  (via drill 0.61)
  Top 0.457: v40.89,45.72 33.27,38.1 10.92,38.1 5.84,33.02 JP17.3
  Bottom 0.457: v40.89,45.72 IC2.28
SDA  (via drill 0.61)
  Top 0.457: v40.89,42.67 29.97,31.75 7.11,31.75 5.84,30.48 JP17.2
  Bottom 0.457: IC2.27 46.99,42.67 v40.89,42.67
TX  (via drill 0.61)
  Top 0.457: v41.15,27.69 41.15,26.67 26.67,12.19 JP7.2
  Bottom 0.457: IC2.3 49.53,32.26 45.72,32.26 v41.15,27.69

### Text on the board
tPlace: + | + | + | + | + | ENDSTOP #1 | IN | +24V | GND | ENDSTOP #2 | IN | +24V | GND | GND | SCL | SDA | ENDSTOP #3 | +5V | DOOR CONTROL v 1.3 | IN | GND | +24V | GND | INT | GND | CTS | +5V | RX | TX | DTR | OPEN/CLOSE | OPEN/CLOSE